# EAGLE design TPS61169_Tant (EAGLE 6.5.0)

## Sheet 1 of 2

## Sheet 2 of 2
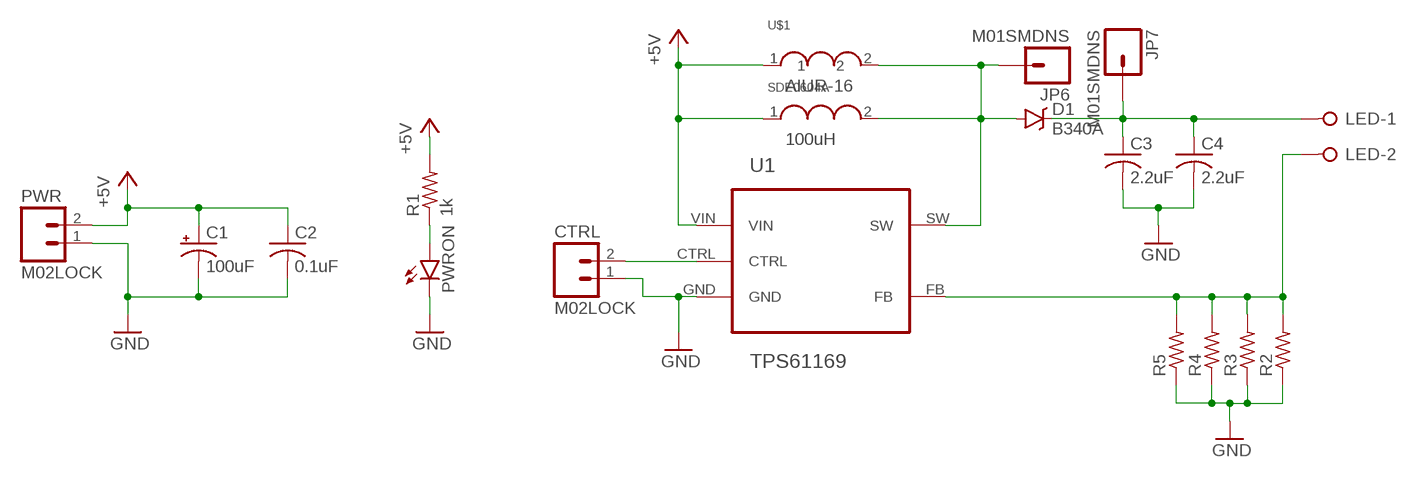
[diagram p0: schematic, sheet 2]

### Parts
AIUR-16  100uH  AIUR-16  [3MM_LEADS_7MM]
C1  100uF  CPOL-USSMCC  [SMC_C]
C2  0.1uF  C-USC0805  [C0805]
C3  2.2uF  C-USC0805  [C0805]
C4  2.2uF  C-USC0805  [C0805]
CTRL  M02LOCK  [1X02_LOCK]
D1  B340A  DIODE-SCHOTTKY-B340A  [SMA-DIODE]
JP6  M01SMDNS  [1X01NS]
JP7  M01SMDNS  [1X01NS]
LED  W237-02P  [W237-132]
PWR  M02LOCK  [1X02_LOCK]
PWRON  LED1206  [LED-1206]
R1  1k  R-US_R0805  [R0805]
R2  R-US_R0805  [R0805]
R3  R-US_R0805  [R0805]
R4  R-US_R0805  [R0805]
R5  R-US_R0805  [R0805]
U1  TPS61169  74AHCT1G04GW/T1  [SOT65P210X110-5N]
U$1  SDE0604A  [BOURNS_SMD]

### Nets
+5V: AIUR-16.1 C1.+ C2.1 PWR.2 R1.2 U1.VIN U$1.1
GND: C1.- C2.2 C3.2 C4.2 CTRL.1 PWR.1 PWRON.C R2.1 R3.1 R4.1 R5.1 U1.GND
N$1: CTRL.2 U1.CTRL
N$2: AIUR-16.2 D1.A JP6.1 U1.SW U$1.2
N$3: LED.2 R2.2 R3.2 R4.2 R5.2 U1.FB
N$4: C3.1 C4.1 D1.C JP7.1 LED.1
N$5: PWRON.A R1.1

## Library data of the parts
AIUR-16 = inductors:AIUR-16
C1 = rcl:CPOL-US: POLARIZED CAPACITOR, American symbol
C2-C4 = rcl:C-US: CAPACITOR, American symbol
CTRL PWR = SparkFun-Connectors:M02: Standard 2-pin 0.1" header. Use with - straight break away headers ( PRT-00116) - right angle break away headers (PRT-00553) - swiss pins (PRT-00743) - machine pins (PRT-00117) - female headers (PRT-00115) Molex polarized connector foot print use with: PRT-08233 with associated crimp pins and housings. 2.54_SCREWTERM for use with PRT-10571. 3.5mm Screw Terminal footprints for PRT-08084 5mm Screw Terminal footprints for use with PRT-08432
D1 = SparkFun-DiscreteSemi:DIODE-SCHOTTKY: Schottky diodes in SFE's production catalog BAT20J 1A 23V 0.62Vf RB751 120mA 40V 0.37Vf PMEG4005EJ 0.5A 40V 0.42Vf MBRA140 1A 40V 0.5Vf B340A 3A 40V SMA; PROD_ID: DIO-09886
JP6 JP7 = SparkFun-Connectors:M01: Header 1 Standard 1-pin 0.1" header. Use with straight break away headers (SKU : PRT-00116), right angle break away headers (PRT-00553), swiss pins (PRT-00743), machine pins (PRT-00117), and female headers (PRT-00115).
LED = con-wago-508:W237-02P: WAGO SREW CLAMP; OC_FARNELL: unknown; OC_NEWARK: unknown
PWRON = SparkFun-LED:LED: LEDs Standard schematic elements and footprints for 5mm, 3mm, 1206, and 0603 sized LEDs. 5mm - Spark Fun Electronics SKU : COM-00529 (and others)
R1-R5 = rcl:R-US_: RESISTOR, American symbol
U1 = TPS61169:74AHCT1G04GW/T1: Inverter; MPN: 74AHCT1G04GW/T1; OC_FARNELL: 1085245; OC_NEWARK: 99K0509; PACKAGE: SOT353-1-5; SUPPLIER: NXP
U$1 = inductors:SDE0604A

## Board
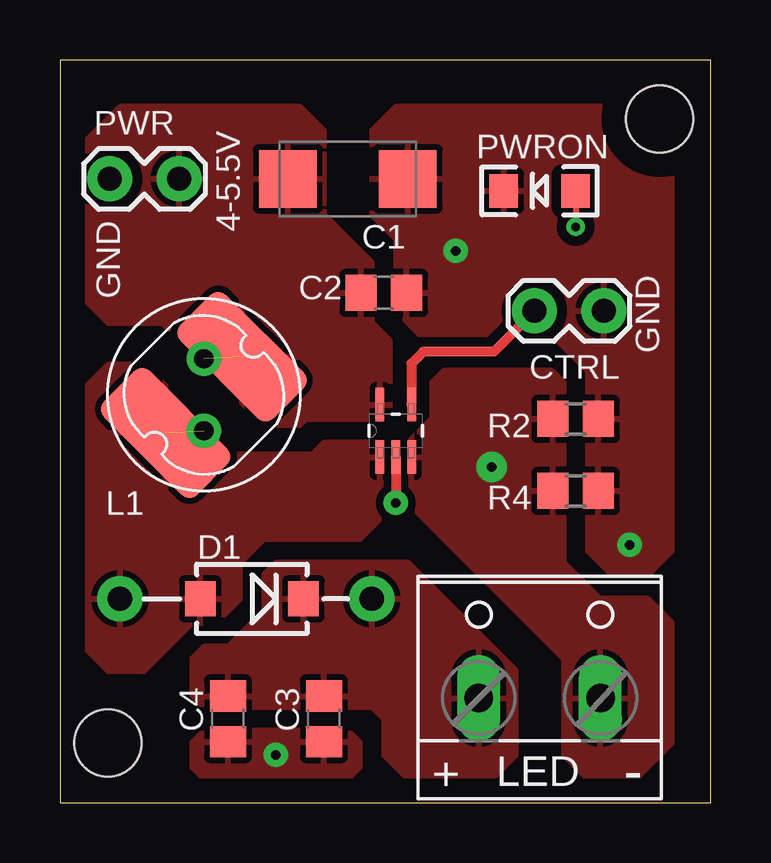
[diagram p1: board, top side]
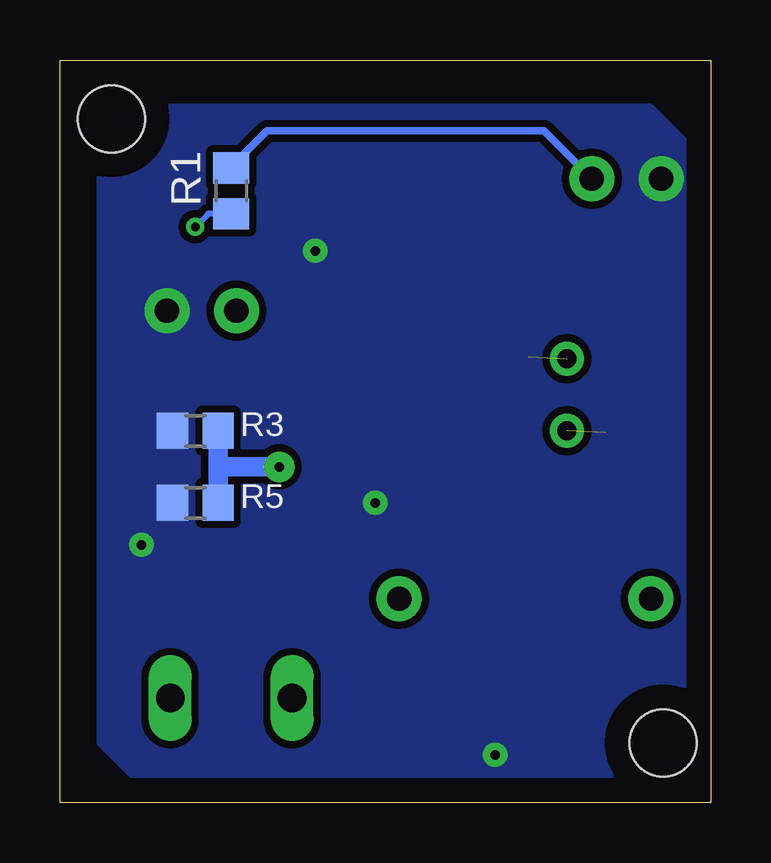
[diagram p2: board, bottom side, seen from below]

Size 27.14 x 30.95 mm. Coordinates in mm from the lower left corner, seen from the top.
Outline: 0,0 27.14,0 27.14,30.95 0,30.95 0,0
Copper layers (1*16): Top 0.035mm / dielectric 1.5mm / Bottom 0.035mm
Design rules "default": minimum track width 10mil, minimum drill 24mil, track to track 8mil, track to pad 8mil, pad to pad 8mil, via to via 8mil, smd to smd 8mil, copper to edge 40mil, drill to drill 8mil, minimum pad ring 10mil, minimum via ring 8mil, stop-mask expansion 4mil, vias tented up to drill 0mil, thermal gap 10mil
Holes 2.8 mm at 2,2.5 25,28.5

### Footprints (pad centres in the part's own frame; a part is rotated, then mirrored left to right if it is on the bottom)
3MM_LEADS_7MM = drill 0.8 pad 1.422: 1 -1.5,0; 2 1.5,0
SMC_C = smd 2.4 x 2.4: + -2.5,0; - 2.5,0
C0805 = smd 1.3 x 1.5: 1 -0.95,0; 2 0.95,0
1X02_LOCK = drill 1.016 pad 1.88: 1 -0.178,0; 2 2.718,0
SMA-DIODE = smd 1.27 x 1.47: A -2.15,0; C 2.15,0
1X01NS = drill 1.016 pad 1.88: 1 0,0
W237-132 = drill 1.194 long: 1 -2.54,-0.635; 2 2.54,-0.635
LED-1206 = smd 1.2 x 1.4: A -1.5,0; C 1.5,0
R0805 = smd 1.3 x 1.5: 1 -0.95,0; 2 0.95,0
SOT65P210X110-5N = smd 1.397 x 0.356: CTRL 1.092,-0.66; FB -1.092,-0.66; GND -1.092,0; SW -1.092,0.66; VIN 1.092,0.66
BOURNS_SMD = smd 2.7 x 5.5: 1 -2.25,0; 2 2.25,0

### Placement (x,y rotation side)
AIUR-16  6,17 270 top
C1  12,26 0 top
C2  13.5,21.25 0 top
C3  11,3.5 270 top
C4  7,3.5 270 top
CTRL  22.5,20.5 180 top
D1  8,8.5 0 top
JP6  2.5,8.5 0 top
JP7  13,8.5 0 top
LED  20,5 0 top
PWR  2.25,26 0 top
PWRON  20,25.5 180 top
R1  20,25.5 90 bottom
R2  21.5,16 180 top
R3  21.5,15.5 0 bottom
R4  21.5,13 180 top
R5  21.5,12.5 0 bottom
U1  14,15.5 90 top
U$1  6,17 225 top

### Tracks (layer width: path | path; a pad name or v marks a point on that pad's centre or on a via)
+5V  (1 unrouted)
  Bottom 0.305: R1.2 20,26.5 18.5,28 6.97,28 PWR.2
  pour Top (isolate 0.406): 11,28 10,29 2.5,29 1,27.5 1,21 2,20 4.25,20 8.5,15.75 10,15.75 10.25,16 13.75,16 13.75,19.25 13,20 13,22.5 11,24.5
GND  (via drill 0.4 pad 1.02)
  Top 0.406: U1.GND v14,12.5
  other vias: 23.75,10.75 16.5,23 9,2
  pour Bottom (isolate 0.305, no thermals): 2.5,1 1,2.5 1,27.5 2.5,29 24,29 25.5,27.5 25.5,2.5 24,1
  pour Top (isolate 0.406): 25.5,27.5 24,29 14,29 13,28 13,24.5 14,23.5 14,20.5 15,19.5 20.5,19.5 22,18 22,10.5 23,9.5 24.5,9.5 25.5,10.5
  pour Top (isolate 0.305): 12.5,2.5 12,3 6,3 5.5,2.5 5.5,1.5 6,1 12,1 12.5,1.5
N$1
  Top 0.305: CTRL.2 19.78,20.48 | 14.65,16.6 U1.CTRL
  Top 0.406: 19.78,20.48 18.1,18.8 15.15,18.8 14.65,18.3 14.65,16.6
N$2  (1 unrouted)
  pour Top (isolate 0.305): 1,17.25 1,6.5 2,5.5 3.5,5.5 5.5,7.5 6.5,7.5 7.5,8.5 7.5,10 8.5,11 12.5,11 13.5,12 13.5,14.75 13.25,15 11,15 10.5,14.5 7.25,14.5 3.5,18.25 2,18.25
N$3  (via drill 0.4 pad 1.27)
  Bottom 0.813: R5.2 20.55,14 | 20.55,14 R3.2 | v18,14 20.55,14
  pour Top (isolate 0.305): 21,17.5 20.5,18 16,18 15.5,17.5 15.5,16 14.5,15 14.5,12.5 21,6 21,2 22,1 24,1 25.5,2.5 25.5,7.5 24.5,8.5 22.5,8.5 21,10
N$4
  pour Top (isolate 0.305): 14.5,10 9,10 8.5,9.5 8.5,8 7,6.5 6,6.5 5.5,6 5.5,4.5 6,4 13,4 13.5,3.5 13.5,2 14.5,1 18,1 19,2 19,5.5
N$5  (via drill 0.35 pad 0.2)
  Top 0.254: PWRON.A v21.5,24
  Bottom 0.254: R1.1 20.95,24.55 v21.5,24

### Text on the board
tPlace: 4-5.5V | GND | GND | L1 | + | -